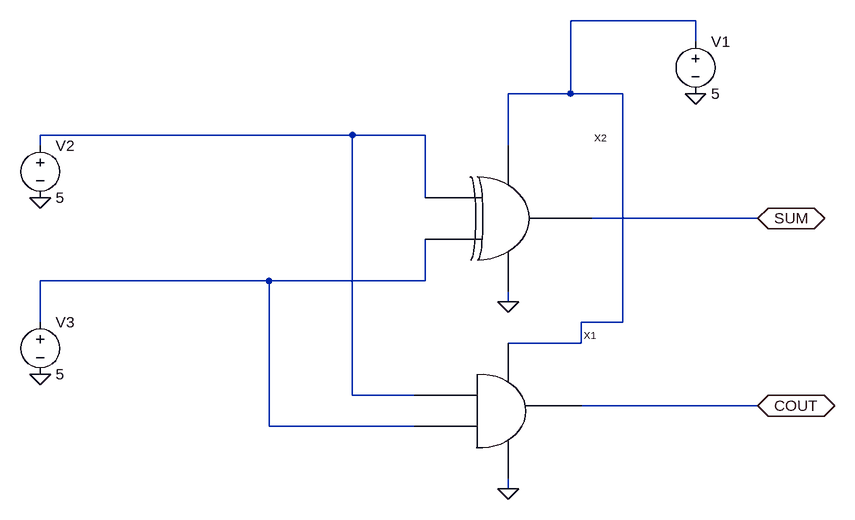
[diagram p0: schematic originalhalfadderimply.asc]
originalhalfadderimply.asc, the LTspice schematic file:
Version 4
SHEET 1 880 680
WIRE 400 -176 208 -176
WIRE 400 -144 400 -176
WIRE 208 -64 208 -176
WIRE 208 -64 112 -64
WIRE 288 -64 208 -64
WIRE -128 0 -608 0
WIRE -16 0 -128 0
WIRE -608 16 -608 0
WIRE 112 16 112 -64
WIRE -16 96 -16 0
WIRE 496 128 240 128
WIRE -256 224 -608 224
WIRE -16 224 -16 160
WIRE -16 224 -256 224
WIRE 112 256 112 240
WIRE -608 288 -608 224
WIRE 288 288 288 -64
WIRE 288 288 224 288
WIRE 224 320 224 288
WIRE 224 320 112 320
WIRE -128 400 -128 0
WIRE -32 400 -128 400
WIRE 496 416 224 416
WIRE -256 448 -256 224
WIRE -32 448 -256 448
WIRE 112 544 112 528
FLAG 496 128 SUM
IOPIN 496 128 BiDir
FLAG 496 416 COUT
IOPIN 496 416 BiDir
FLAG 112 256 0
FLAG 112 544 0
FLAG -608 96 0
FLAG 400 -64 0
FLAG -608 368 0
SYMBOL andgateimply 0 416 R0
SYMATTR InstName X1
SYMBOL xorgateimply 0 128 R0
SYMATTR InstName X2
SYMBOL voltage 400 -160 R0
WINDOW 123 0 0 Left 0
WINDOW 39 0 0 Left 0
SYMATTR InstName V1
SYMATTR Value 5
SYMBOL voltage -608 0 R0
WINDOW 123 0 0 Left 0
WINDOW 39 0 0 Left 0
SYMATTR InstName V2
SYMATTR Value 5
SYMBOL voltage -608 272 R0
WINDOW 123 0 0 Left 0
WINDOW 39 0 0 Left 0
SYMATTR InstName V3
SYMATTR Value 5

The netlist it stands for:
* originalhalfadderimply.asc
XX1 N001 0 N002 N003 COUT andgateimply  ; pins VDD VSS A B OUT
XX2 N002 N003 SUM N001 0 xorgateimply  ; pins A B OUT VDD VSS
V1 N001 0 5
V2 N002 0 5
V3 N003 0 5
.backanno
.end